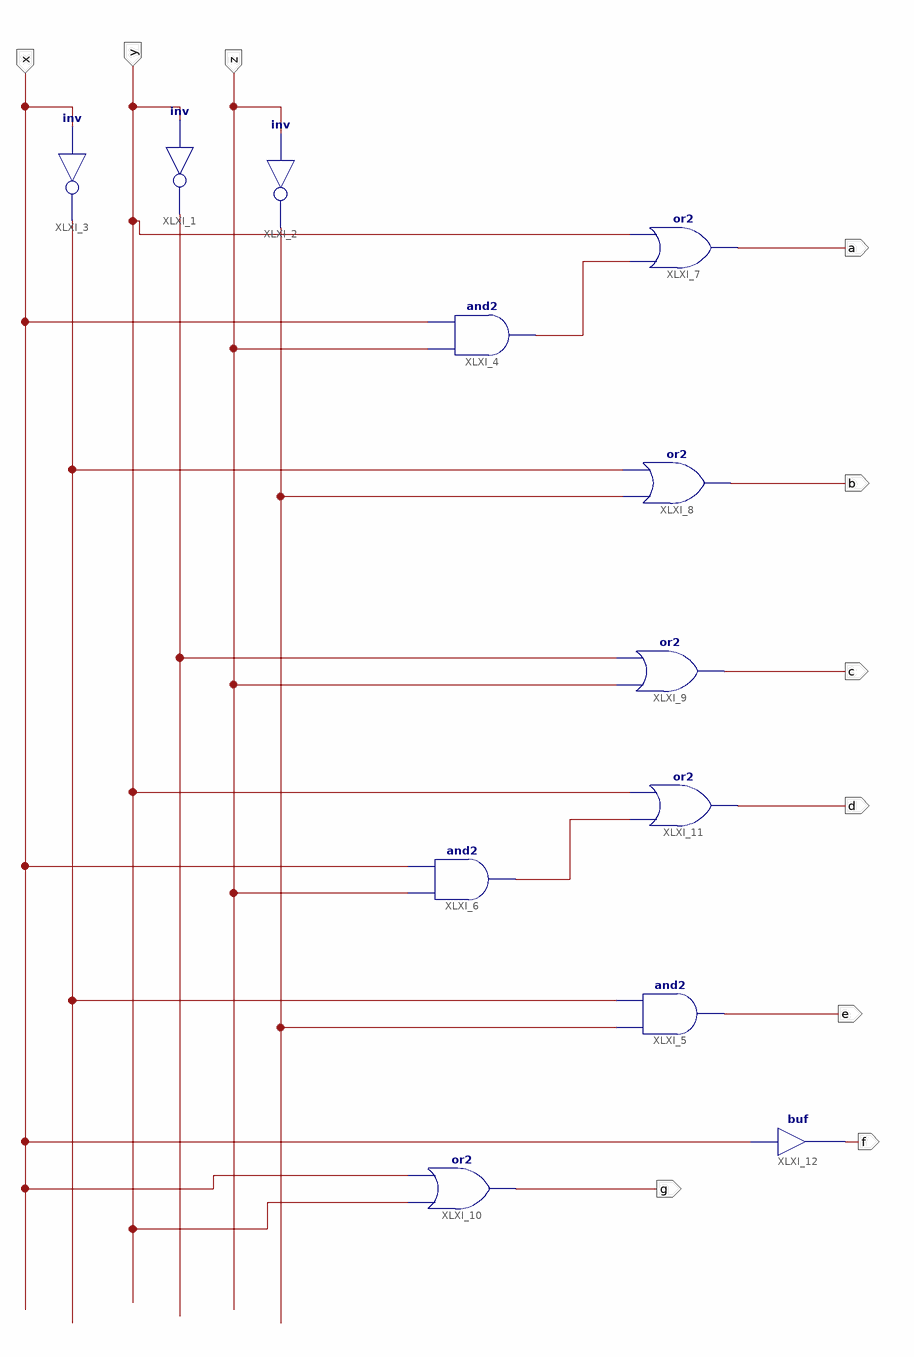
[diagram p0: schematic sheet 1]
// Xilinx ISE schematic bcdtosevenseg.sch (spartan6) as structural Verilog: 12 symbols, 10 ports
module bcdtosevenseg (
  input  y,
  input  x,
  input  z,
  output g,
  output a,
  output b,
  output c,
  output d,
  output e,
  output f
);

  wire XLXN_9, XLXN_10, XLXN_11, XLXN_12, XLXN_13;

  not XLXI_1 (XLXN_10, y);
  not XLXI_2 (XLXN_11, z);
  not XLXI_3 (XLXN_9, x);
  and XLXI_4 (XLXN_12, z, x);
  and XLXI_5 (e, XLXN_11, XLXN_9);
  and XLXI_6 (XLXN_13, z, x);
  or XLXI_7 (a, XLXN_12, y);
  or XLXI_8 (b, XLXN_11, XLXN_9);
  or XLXI_9 (c, z, XLXN_10);
  or XLXI_10 (g, y, x);
  or XLXI_11 (d, XLXN_13, y);
  buf XLXI_12 (f, x);
endmodule
